# EAGLE design inclinometer adxl335 (EAGLE 9.6.2)
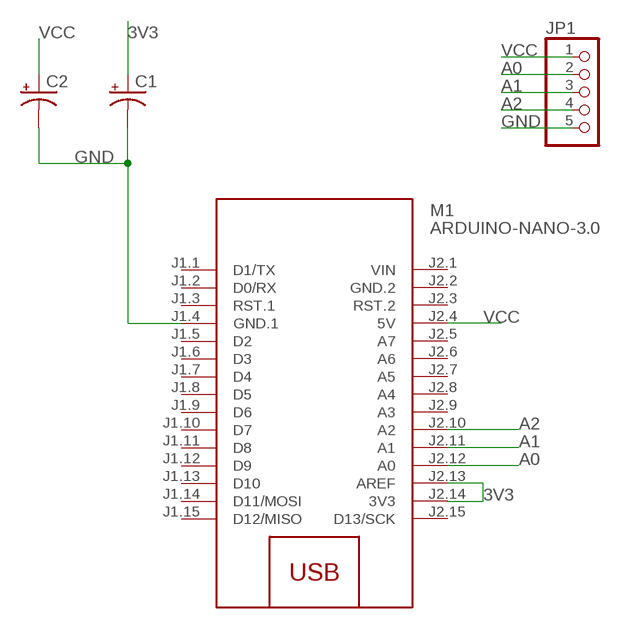
[diagram p0: schematic, sheet 1]

## Parts
C1  CPOL-USE2.5-6  [E2,5-6]
C2  CPOL-USE2.5-6  [E2,5-6]
JP1  PINHD-1X5  [1X05]
M1  ARDUINO-NANO-3.0  [ARDUINO-NANO-3.0]

## Nets
3V3: C1.+ M1.J2.13(AREF) M1.J2.14(3V3)
A0: JP1.2 M1.J2.12(A0)
A1: JP1.3 M1.J2.11(A1)
A2: JP1.4 M1.J2.10(A2)
GND: C1.- C2.- JP1.5 M1.J1.4(GND.1)
VCC: C2.+ JP1.1 M1.J2.4(5V)
Unconnected: M1.J1.1(D1/TX) M1.J1.2(D0/RX) M1.J1.3(RST.1) M1.J1.5(D2) M1.J1.6(D3) M1.J1.7(D4) M1.J1.8(D5) M1.J1.9(D6) M1.J1.10(D7) M1.J1.11(D8) M1.J1.12(D9) M1.J1.13(D10) M1.J1.14(D11/MOSI) M1.J1.15(D12/MISO) M1.J2.3(RST.2) M1.J2.5(A7) M1.J2.6(A6) M1.J2.7(A5) M1.J2.8(A4) M1.J2.9(A3) M1.J2.15(D13/SCK)

## Power pins joined to a net without a drawn wire
GND.2: M1.J2.2(GND.2)
VIN: M1.J2.1(VIN)

## Library data of the parts
C1 C2 = rcl:CPOL-US: POLARIZED CAPACITOR, American symbol; SPICEPREFIX: C
JP1 = pinhead:PINHD-1X5: PIN HEADER
M1 = diy-modules:ARDUINO-NANO-3.0: Arduino Nano 3.0 and compatible devices More details available here: https://www.arduino.cc/en/Main/ArduinoBoardNano Click here to find device on ebay.com <http://www.ebay.com/sch/arduino+nano>

## Board
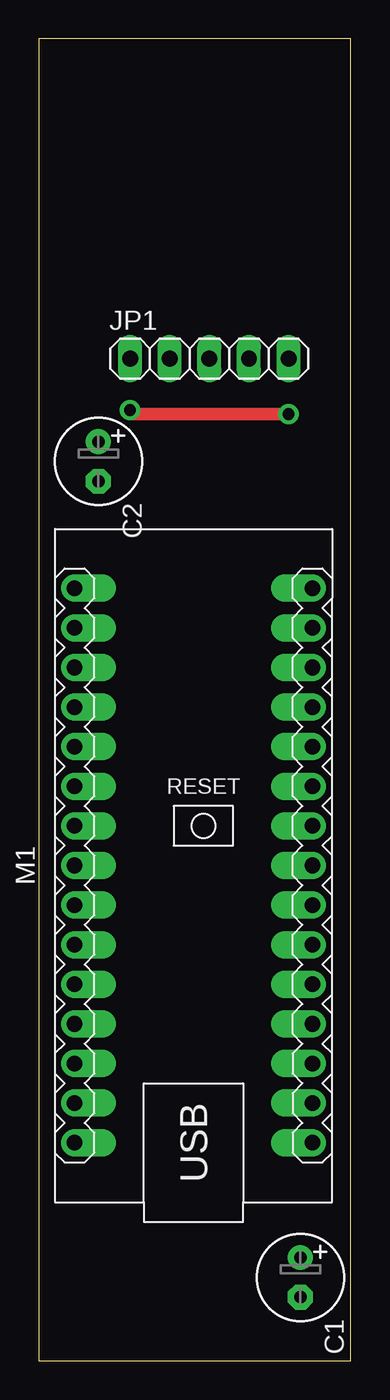
[diagram p1: board, top side]
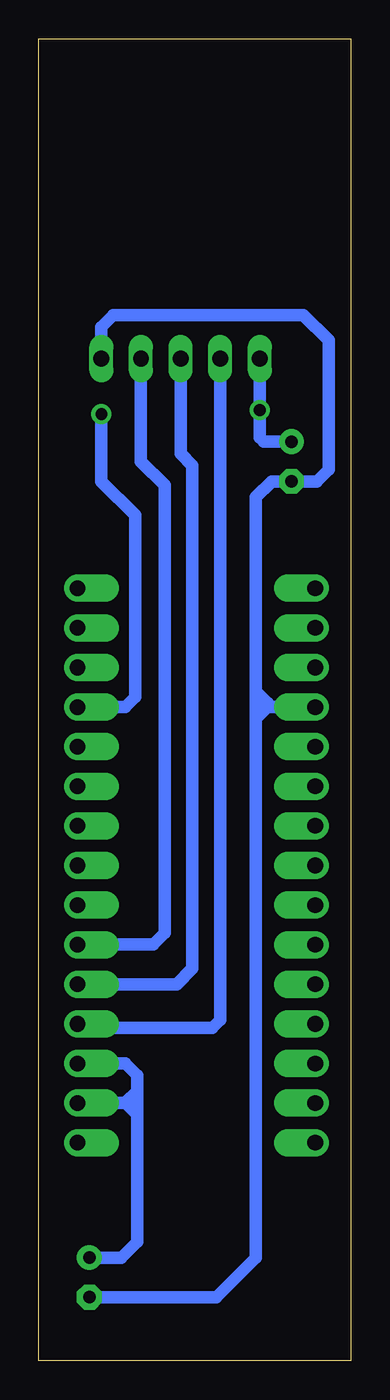
[diagram p2: board, bottom side, seen from below]

Size 20 x 84.76 mm. Coordinates in mm from the lower left corner, seen from the top.
Outline: 0,0 20,0 20,84.76 0,84.76 0,0
Copper layers (1*16): Top 0.035mm / dielectric 1.5mm / Bottom 0.035mm
Design rules "default *": minimum track width 32mil, minimum drill 1mm, track to track 24mil, track to pad 24mil, pad to pad 24mil, via to via 24mil, smd to smd 24mil, copper to edge 0mil, drill to drill 6mil, minimum pad ring 10mil, minimum via ring 8mil, stop-mask expansion 4mil, vias tented up to drill 0mil, thermal gap 10mil

### Footprints (pad centres in the part's own frame; a part is rotated, then mirrored left to right if it is on the bottom)
E2,5-6 = drill 0.813 pad 1.6: + -1.27,0 | drill 0.813 pad 1.6 octagon: - 1.27,0
1X05 = drill 1.016 long: 1 -5.08,0; 2 -2.54,0; 3 0,0; 4 2.54,0; 5 5.08,0
ARDUINO-NANO-3.0 = drill 1 pad 1.778 offset: J1.1 17.78,7.62; J1.2 15.24,7.62; J1.3 12.7,7.62; J1.4 10.16,7.62; J1.5 7.62,7.62; J1.6 5.08,7.62; J1.7 2.54,7.62; J1.8 0,7.62; J1.9 -2.54,7.62; J1.10 -5.08,7.62; J1.11 -7.62,7.62; J1.12 -10.16,7.62; J1.13 -12.7,7.62; J1.14 -15.24,7.62; J1.15 -17.78,7.62; J2.1 17.78,-7.62; J2.2 15.24,-7.62; J2.3 12.7,-7.62; J2.4 10.16,-7.62; J2.5 7.62,-7.62; J2.6 5.08,-7.62; J2.7 2.54,-7.62; J2.8 0,-7.62; J2.9 -2.54,-7.62; J2.10 -5.08,-7.62; J2.11 -7.62,-7.62; J2.12 -10.16,-7.62; J2.13 -12.7,-7.62; J2.14 -15.24,-7.62; J2.15 -17.78,-7.62

### Placement (x,y rotation side)
C1  16.76,5.33 270 top
C2  3.81,57.66 270 top
JP1  10.92,64.26 0 top
M1  9.91,31.75 90 top

### Tracks (layer width: path | path; a pad name or v marks a point on that pad's centre or on a via)
3V3
  Bottom 0.813: M1.J2.14 14.48,16.51 | 13.72,16.51 14.48,16.51 | 13.72,16.51 13.72,15.75 | 13.72,15.75 13.72,7.62 14.73,6.6 C1.+ | M1.J2.13 14.48,19.05 13.72,18.29 13.72,17.27 | 13.72,17.27 13.72,16.51 | 13.72,15.75 14.48,16.51 | 14.48,16.51 13.72,17.27
A0
  Bottom 0.813: M1.J2.12 17.27,21.34 8.89,21.34 8.38,21.84 JP1.2
A1
  Bottom 0.813: 17.4,24.26 M1.J2.11 11.18,24.13 10.16,25.15 10.16,57.4 10.92,58.17 JP1.3
A2
  Bottom 0.813: JP1.4 13.46,57.66 11.94,56.13 11.94,27.43 12.68,26.7 17.5,26.7 M1.J2.10
GND
  Bottom 0.813: C1.- 8.64,4.06 6.1,6.6 6.1,41.15 | 6.1,41.15 5.33,41.91 | 5.33,41.91 M1.J1.4 | 6.1,42.93 6.1,55.37 5.08,56.39 C2.- 2.18,56.39 1.42,57.15 1.42,65.43 3.05,67.06 15.24,67.06 16,66.29 JP1.5 | 6.1,42.93 6.1,41.15 | 5.33,41.91 5.33,42.16 6.1,42.93
VCC  (via drill 0.75 pad 1.3)
  Top 0.813: v16,60.71 6.1,60.71 v5.84,60.96
  Bottom 0.813: C2.+ 5.59,58.93 5.84,59.18 v5.84,60.96 JP1.1 | M1.J2.4 14.48,41.91 13.84,42.55 13.84,54.23 16,56.39 v16,60.71